# EAGLE design pre-charger-v1.1 (EAGLE 7.7.0)
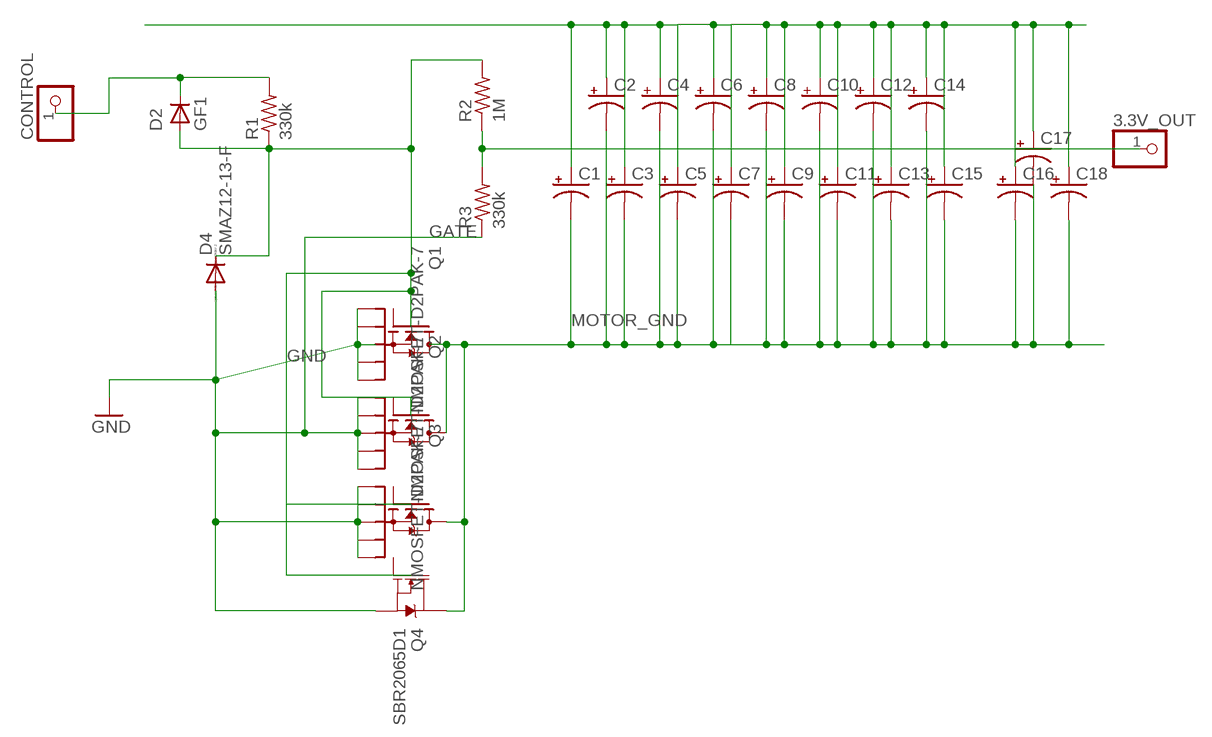
[diagram p0: schematic, sheet 1]

## Parts
3.3V_OUT  PINHD-1X1  [1X01]
C1  CPOL-USE3.5-8  [E3,5-8]
C2  CPOL-USE3.5-8  [E3,5-8]
C3  CPOL-USE3.5-8  [E3,5-8]
C4  CPOL-USE3.5-8  [E3,5-8]
C5  CPOL-USE3.5-8  [E3,5-8]
C6  CPOL-USE3.5-8  [E3,5-8]
C7  CPOL-USE3.5-8  [E3,5-8]
C8  CPOL-USE3.5-8  [E3,5-8]
C9  CPOL-USE3.5-8  [E3,5-8]
C10  CPOL-USE3.5-8  [E3,5-8]
C11  CPOL-USE3.5-8  [E3,5-8]
C12  CPOL-USE3.5-8  [E3,5-8]
C13  CPOL-USE3.5-8  [E3,5-8]
C14  CPOL-USE3.5-8  [E3,5-8]
C15  CPOL-USE3.5-8  [E3,5-8]
C16  CPOL-USE5-13  [E5-13]
C17  CPOL-USE5-13  [E5-13]
C18  CPOL-USE5-13  [E5-13]
CONTROL  PINHD-1X1  [1X01]
D2  GF1  [SMA-DO214AC]
D4  SMAZ12-13-F  DIODE-DO-214AC  [DO-214AC]
Q1  NMOSFET-D2PAK-7  [D2PAK-7]
Q2  NMOSFET-D2PAK-7  [D2PAK-7]
Q3  NMOSFET-D2PAK-7  [D2PAK-7]
Q4  SBR2065D1  MOSFET-NCH-FDD8780  [DPAK]
R1  330k  R-US_R0603  [R0603]
R2  1M  R-US_R0603  [R0603]
R3  330k  R-US_R0603  [R0603]

## Nets
3.3V_OUT: 3.3V_OUT.1 R2.1 R3.2
GATE: D2.A D4.C R1.1 R2.2
GND: D4.A Q1.S1 Q1.S2 Q1.S3 Q1.S4 Q1.S5 Q2.S1 Q2.S5 Q3.S1 Q3.S5 Q4.3(S) R3.1
MOTOR_GND [power]: C1.- C2.- C3.- C4.- C5.- C6.- C7.- C8.- C9.- C10.- C11.- C12.- C13.- C14.- C15.- C16.- C17.- C18.- Q1.D Q2.D Q3.D Q4.4(D)
N$2: CONTROL.1 D2.K(C) R1.2
V_BATT [power]: C1.+ C2.+ C3.+ C4.+ C5.+ C6.+ C7.+ C8.+ C9.+ C10.+ C11.+ C12.+ C13.+ C14.+ C15.+ C16.+ C17.+ C18.+
Unconnected: Q1.G Q2.G Q2.S2 Q2.S3 Q2.S4 Q3.G Q3.S2 Q3.S3 Q3.S4 Q4.1(G)

## Library data of the parts
3.3V_OUT CONTROL = pinhead:PINHD-1X1: PIN HEADER
C1-C18 = rcl:CPOL-US: POLARIZED CAPACITOR, American symbol
D2 = diode:GF1: DIODE
D4 = diode:DIODE-: DIODE
Q1-Q3 = D2PAK-7:NMOSFET-D2PAK-7
Q4 = SparkFun-DiscreteSemi:MOSFET-NCH: N-channel MOSFETs Voltage controlled devices that allow control of high current outputs. SparkFun Products: SparkFun OpenScale <https://www.sparkfun.com/products/13261> SparkFun Digital Sandbox <https://www.sparkfun.com/products/12651> SparkFun Monster Moto Shield <https://www.sparkfun.com/products/10182> SparkFun MOSFET Power Controller <https://www.sparkfun.com/products/11214>; PROD_ID: TRANS-09984; VALUE: 35A/25V/8.5mΩ
R1-R3 = rcl:R-US_: RESISTOR, American symbol

## Net classes
1 power: width 1.016 mm

## Board
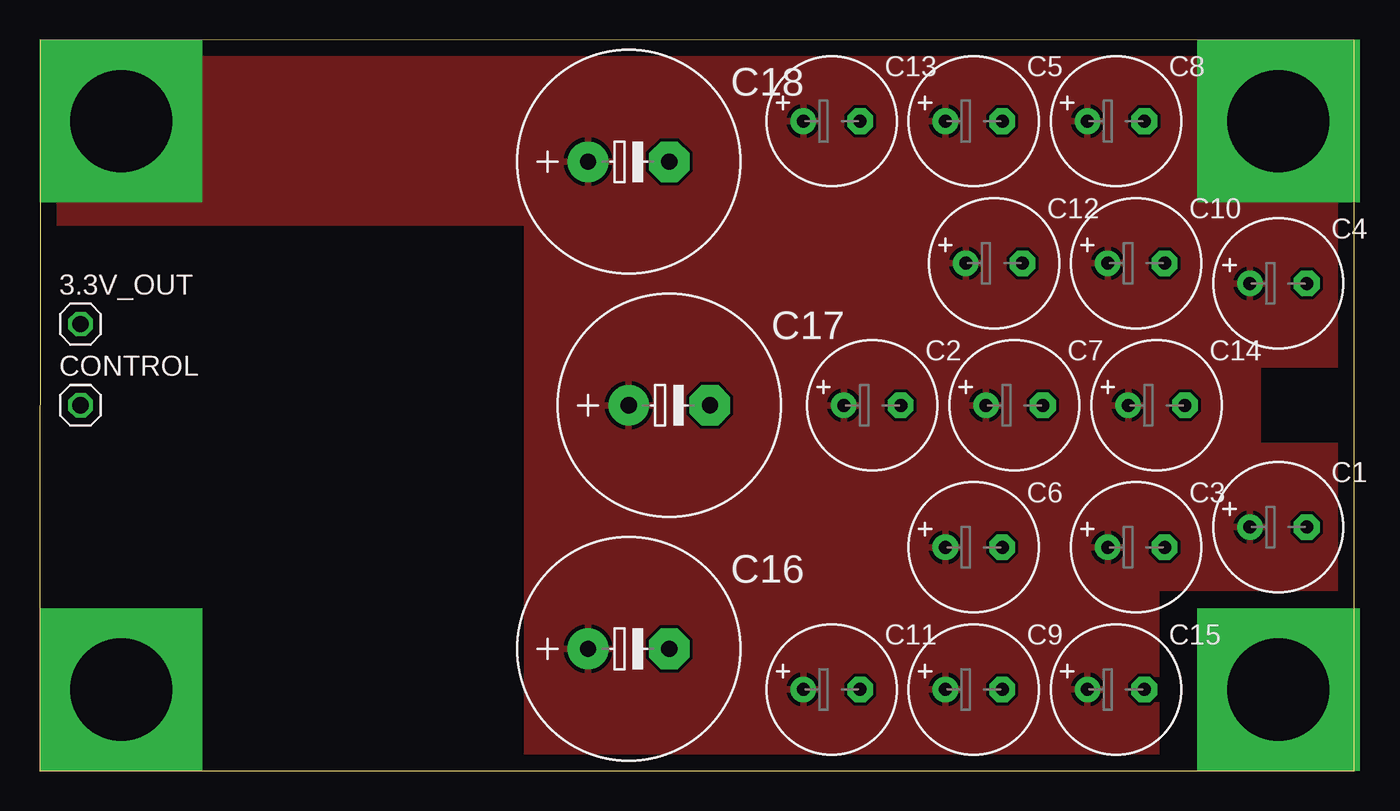
[diagram p1: board, top side]
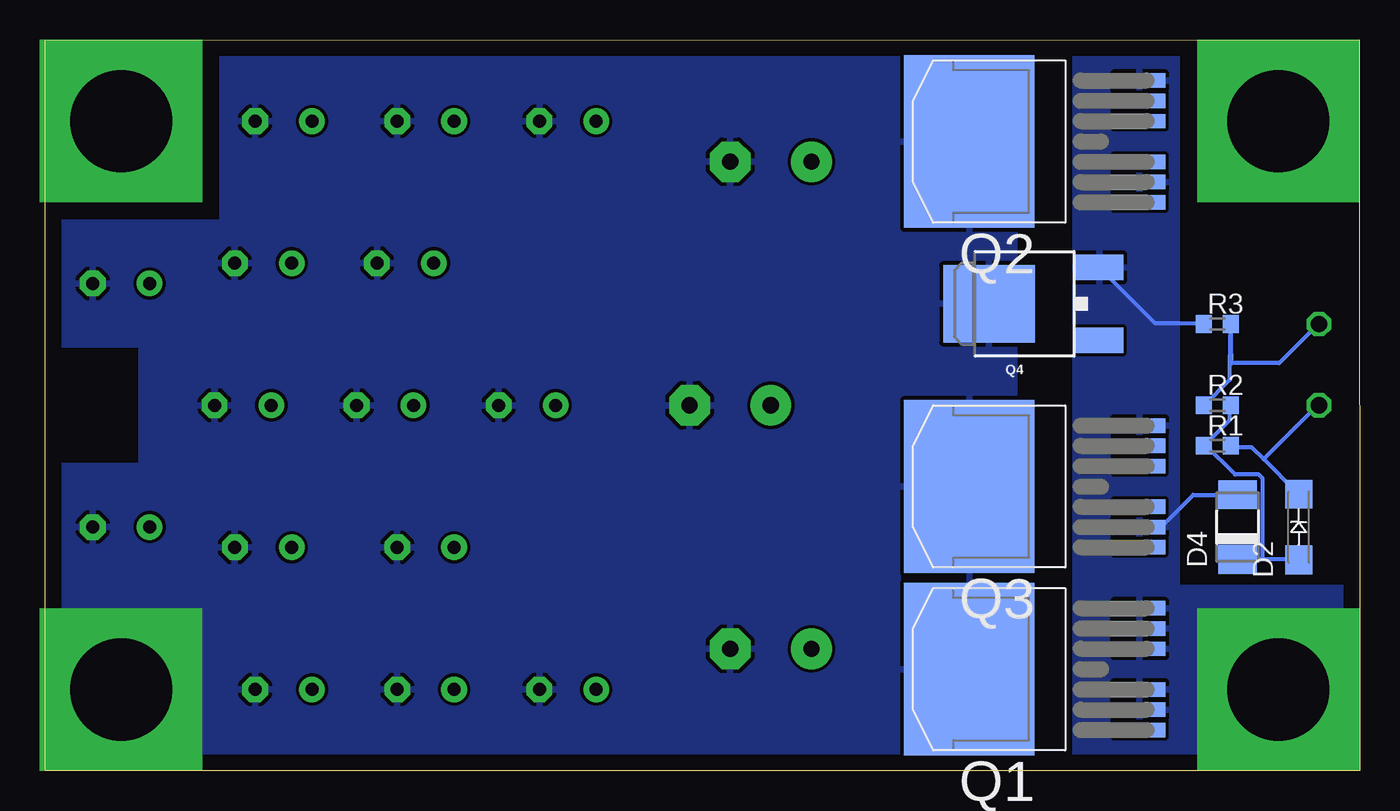
[diagram p2: board, bottom side, seen from below]

Size 82.22 x 45.72 mm. Coordinates in mm from the lower left corner, seen from the top.
Outline: 0,0 82.22,0 82.22,45.71 0.01,45.72 0,0
Copper layers (1*16): Top 0.035mm / dielectric 1.5mm / Bottom 0.035mm
Design rules "default": minimum track width 10mil, minimum drill 24mil, track to track 8mil, track to pad 8mil, pad to pad 8mil, via to via 8mil, smd to smd 8mil, copper to edge 40mil, drill to drill 8mil, minimum pad ring 10mil, minimum via ring 8mil, stop-mask expansion 4mil, vias tented up to drill 0mil, thermal gap 10mil

### Footprints (pad centres in the part's own frame; a part is rotated, then mirrored left to right if it is on the bottom)
1X01 = drill 1.016 octagon: 1 0,0
E3,5-8 = drill 0.813 pad 1.6: + -1.778,0 | drill 0.813 pad 1.6 octagon: - 1.778,0
E5-13 = drill 1.016 pad 2.54: + -2.54,0 | drill 1.016 pad 2.54 octagon: - 2.54,0
SMA-DO214AC = smd 1.8 x 1.7: A -2.05,0; K 2.05,0
DO-214AC = smd 1.8 x 2.4: A 2.025,0; C -2.025,0
D2PAK-7 = smd 10.8 x 8.15: D 0,4.1 | smd 0.9 x 3.2: G -3.81,-6.56; S1 -2.54,-6.56; S2 -1.27,-6.56; S3 1.27,-6.56; S4 2.54,-6.56; S5 3.81,-6.56
DPAK = smd 1.6 x 3: 1 -2.28,-5.31; 3 2.28,-5.31 | smd 4.826 x 5.715: 4 0,1.588
R0603 = smd 1 x 1.1: 1 -0.85,0; 2 0.85,0

### Placement (x,y rotation side)
3.3V_OUT  2.54,27.94 0 top
C1  77.47,15.24 0 top
C2  52.07,22.86 0 top
C3  68.58,13.97 0 top
C4  77.47,30.48 0 top
C5  58.42,40.64 0 top
C6  58.42,13.97 0 top
C7  60.96,22.86 0 top
C8  67.31,40.64 0 top
C9  58.42,5.08 0 top
C10  68.58,31.75 0 top
C11  49.53,5.08 0 top
C12  59.69,31.75 0 top
C13  49.53,40.64 0 top
C14  69.85,22.86 0 top
C15  67.31,5.08 0 top
C16  36.83,7.62 0 top
C17  39.37,22.86 0 top
C18  36.83,38.1 0 top
CONTROL  2.54,22.86 0 top
D2  3.81,15.24 90 bottom
D4  7.62,15.24 90 bottom
Q1  20.32,6.35 90 bottom
Q2  20.32,39.37 90 bottom
Q3  20.32,17.78 90 bottom
Q4  21.59,29.21 90 bottom
R1  8.89,20.32 0 bottom
R2  8.89,22.86 0 bottom
R3  8.89,27.94 0 bottom

### Tracks (layer width: path | path; a pad name or v marks a point on that pad's centre or on a via)
3.3V_OUT
  Bottom 0.254: R2.1 9.72,22.86 8.12,24.46 8.12,25.38 R3.2 8,25.49 5.03,25.49 2.63,27.89 3.3V_OUT.1
GATE
  Bottom 0.254: R2.2 8.12,22.86 8.12,21.95 9.72,20.34 R1.1 9.6,20.34 7.77,18.52 6.29,18.52 6.06,18.29 6.06,13.26 | 6.06,13.26 7.54,13.26 D4.C | 6.06,13.26 3.89,13.26 D2.A
GND  (via drill 6.4 pad 10.16)
  Bottom 0.254: D4.A 7.66,17.26 10.4,17.26 12.34,15.32 13.72,15.32 Q3.S1 | R3.1 9.83,28 12.8,28 16.23,31.43 Q4.3
  other vias: 5.08,5.08
  pour Bottom: 17.78,46.99 11.43,46.99 11.43,11.43 0,11.43 0,0 17.78,0
MOTOR_GND  (via drill 6.4 pad 10.16)
  other vias: 77.47,5.08
  pour Bottom: 21.59,48.26 21.59,0 62.23,0 62.23,27.94 46.99,27.94 46.99,48.26
  pour Bottom: 62.23,27.94 76.2,27.94 76.2,0 60.96,0
  pour Bottom: 82.55,19.05 76.2,19.05 76.2,0 82.55,0
  pour Bottom: 45.72,45.72 45.72,26.67 82.55,26.67 82.55,27.94 82.55,34.29 71.12,34.29 71.12,45.72
N$2
  Bottom 0.254: 6,19.49 3.89,17.37 D2.K | 6,19.49 6.74,20.23 8,20.23 R1.2 | 6,19.49 2.63,22.86 CONTROL.1
V_BATT  (via drill 6.4 pad 10.16)
  other vias: 5.08,40.64 77.47,40.64
  pour Top: 30.48,45.72 30.48,0 69.85,0 69.85,1.27 69.85,11.43 82.55,11.43 82.55,20.32 76.2,20.32 76.2,25.4 82.55,25.4 82.55,26.67 82.55,45.72
  pour Top: 31.75,45.72 31.75,34.29 0,34.29 0,45.72